# Altium schematic sheet USBHeaders.SchDoc
size A
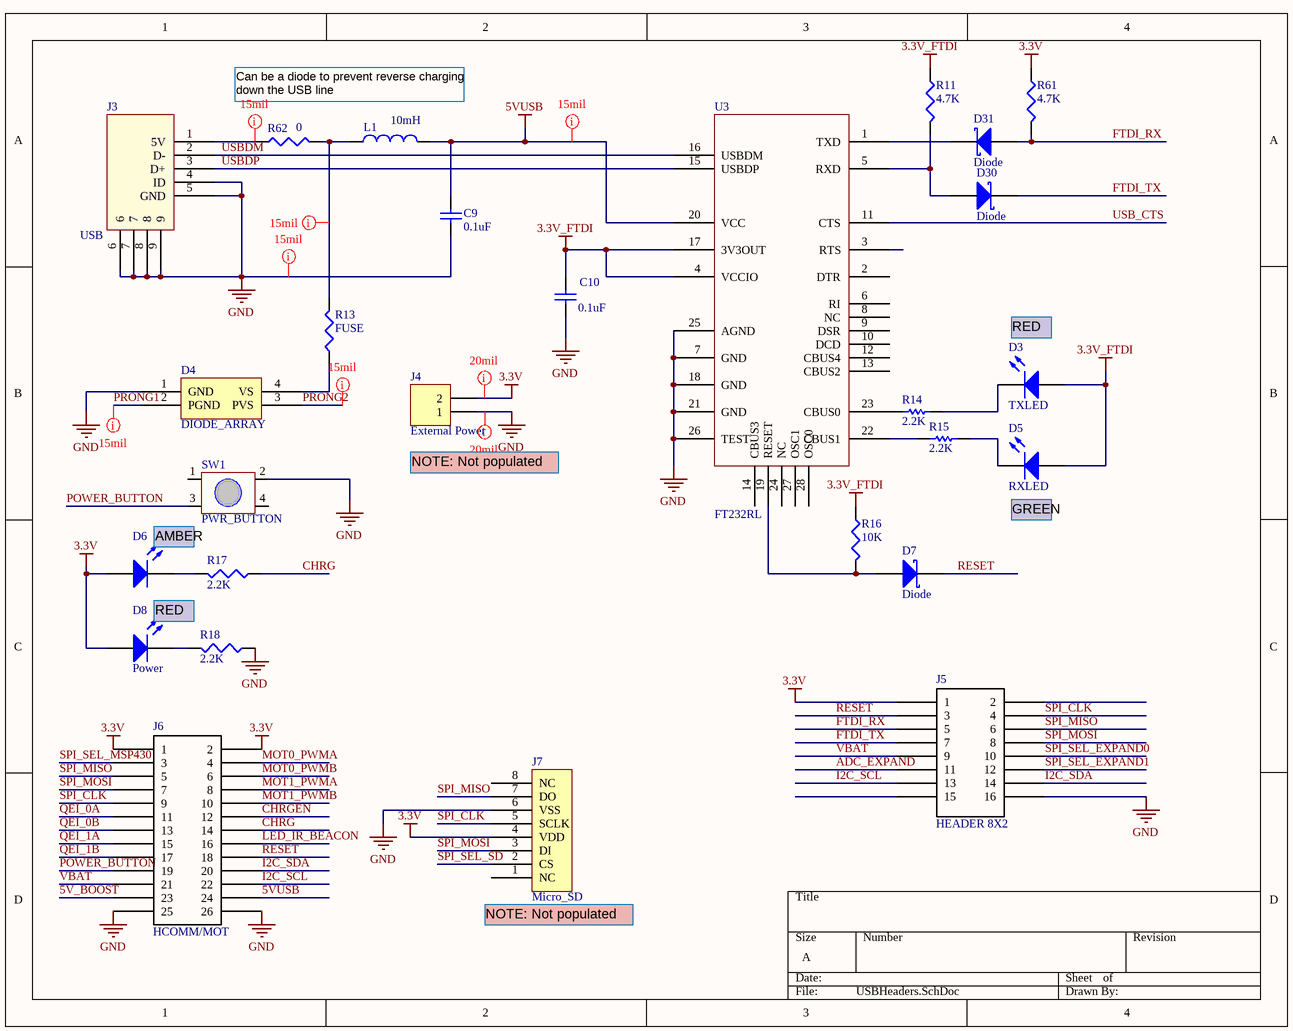
[diagram p0: USBHeaders.SchDoc]

## Parts
C9  value 0.1uF  [CAPC1005L]
C10  value 0.1uF  [CAPC1005L]
D3  TXLED  [SurfaceMount(603)]
D4  DIODE_ARRAY  [SOT143]
D5  RXLED  [SurfaceMount(603)]
D6  Charge  [SurfaceMount(603)]  (value not drawn)
D7  Diode  [SurfaceMount(603)]
D8  Power  [SurfaceMount(603)]
D30  Diode  [SurfaceMount(603)]
D31  Diode  [SurfaceMount(603)]
J3  USB  [USB Minib (thru-hole)]
J4  External Power  [HDR1X2]
J5  HEADER 8X2  [HEADERSM 8X2]
J6  HCOMM/MOT  [HeaderSM 13x2]
J7  Micro_SD  [MICRO_SD]
L1  value 10mH  [INDC2012L]  (hidden comment: Inductor)
R11  value 4.7K  [RESC1608L]  (hidden comment: Res3)
R13  value FUSE  [RESC3225L]  (hidden comment: Res3)
R14  value 2.2K  [RESC1608L]
R15  value 2.2K  [RESC1608L]
R16  value 10K  [RESC1608L]  (hidden comment: Res3)
R17  value 2.2K  [RESC1608L]  (hidden comment: Res3)
R18  value 2.2K  [RESC1608L]  (hidden comment: Res3)
R61  value 4.7K  [RESC1608L]  (hidden comment: Res3)
R62  value 0  [RESC1608L]  (hidden comment: Res3)
SW1  PWR_BUTTON  [SwitchTall-TL330]
U3  FT232RL  [SSOP-28]

## Nets
3.3V: D6.1(A) D8.1(A) J4.2 J5.1 J6.1 J6.2 J7.4(VDD) R61.1
3.3V_FTDI: C10.2 D3.1(A) D5.1(A) R11.1 R16.1 U3.4(VCCIO) U3.17(3V3OUT)
5VUSB: C9.2 J6.24 L1.2 U3.20(VCC)
GND: C9.1 C10.1 D4.1(GND) J3.4(ID) J3.5(GND) J3.6 J3.7 J3.8 J3.9 J4.1 J5.16 J6.25 J6.26 J7.6(VSS) R18.1 SW1.2 U3.7(GND) U3.18(GND) U3.21(GND) U3.25(AGND) U3.26(TEST)
5V_BOOST: J6.23
ADC_EXPAND: J5.11
CHRG: J6.14 R17.1
CHRGEN: J6.12
FTDI_RX: D31.2(A) J5.5 R61.2
FTDI_TX: D30.1(K) J5.7
I2C_SCL: J5.13 J6.22
I2C_SDA: J5.14 J6.20
LED_IR_BEACON: J6.16
MOT0_PWMA: J6.4
MOT0_PWMB: J6.6
MOT1_PWMA: J6.8
MOT1_PWMB: J6.10
POWER_BUTTON: J6.19 SW1.3
PRONG1: D4.2(PGND)
PRONG2: D4.3(PVS)
QEI_0A: J6.11
QEI_0B: J6.13
QEI_1A: J6.15
QEI_1B: J6.17
RESET: D7.1(K) J5.3 J6.18
SPI_CLK: J5.4 J6.9 J7.5(SCLK)
SPI_MISO: J5.6 J6.5 J7.7(DO)
SPI_MOSI: J5.8 J6.7 J7.3(DI)
SPI_SEL_EXPAND0: J5.10
SPI_SEL_EXPAND1: J5.12
SPI_SEL_MSP430: J6.3
SPI_SEL_SD: J7.2(CS)
USB_CTS: U3.11(CTS)
USBDM: J3.2(D-) U3.16(USBDM)
USBDP: J3.3(D+) U3.15(USBDP)
VBAT: J5.9 J6.21
NetD3_2: D3.2(K) R14.2
NetD4_4: D4.4(VS) R13.1
NetD5_2: D5.2(K) R15.2
NetD6_2: D6.2(K) R17.2
NetD7_2: D7.2(A) R16.2 U3.19(RESET)
NetD8_2: D8.2(K) R18.2
NetD30_2: D30.2(A) R11.2 U3.5(RXD)
NetD31_1: D31.1(K) U3.1(TXD)
NetJ3_1: J3.1(5V) R62.1
NetL1_1: L1.1 R13.2 R62.2
NetR14_1: R14.1 U3.23(CBUS0)
NetR15_1: R15.1 U3.22(CBUS1)

Not connected (* = marked no-connect by the designer): J5 2 15; J7 1(NC) 8(NC); SW1 1 4; U3 2(DTR) 3(RTS) 6(RI) 8(NC) 9(DSR) 10(DCD) 12(CBUS4) 13(CBUS2) 14(CBUS3) 24(NC) 27(OSC1) 28(OSC0)

## Layout directives
rule Width Constraint [Pref Width = 15mil    Min Width = 8mil    Max Width = 20mil]: 3.3V, GND
rule Width Constraint [Pref Width = 8mil    Min Width = 8mil    Max Width = 15mil]: 5VUSB, GND, NetJ3_1, NetL1_1, PRONG1, PRONG2

## Notes on the sheet
- Can be a diode to prevent reverse charging down the USB line
- (near D3) RED
- (near J4) NOTE: Not populated
- (near D5) GREEN
- AMBER
- RED
- (near J7) NOTE: Not populated

## Library data of the parts
C9 C10 = Cap: Capacitor; Published: 8-Jun-2000; LatestRevisionDate: 17-Jul-2002; LatestRevisionNote: Re-released for DXP Platform.; PackageReference: RAD-0.3; Publisher: Altium Limited
D3 D5 D6 = LED2: Typical RED, GREEN, YELLOW, AMBER GaAs LED; Published: 8-Jun-2000; LatestRevisionDate: 17-Jul-2002; LatestRevisionNote: Re-released for DXP Platform.; PackageVersion: Feb-2002; PackageReference: 3.2X1.6X1.1; Publisher: Altium Limited
D4 = SCHOTTKEY_DIODE_ARRAY
D7 D30 D31 = SchottkeyDiode
D8 = LED
J3 = USB-ConnTH
J4 = Header 2: Header, 2-Pin; LatestRevisionDate: 17-Jul-2002; LatestRevisionNote: Re-released for DXP Platform.; Publisher: Altium Limited
J5 = HEADERS 8X2
J6 = HCOMM/HMOT: Header, 2X20, 50mil, IDC
L1 = Inductor: Code_IEC: 1005; Published: 8-Jun-2000; LatestRevisionDate: 29-May-2009; LatestRevisionNote: IPC-7351 Footprint Added.; PackageReference: 0402-A; Publisher: Altium Limited; PackageDescription: Chip Inductor; Code_JEITA: 0402
R11 R13 R16-R18 R61 R62 = Res3: Resistor; Published: 8-Jun-2000; LatestRevisionDate: 29-May-2009; LatestRevisionNote: IPC-7351 Footprint Added.; PackageReference: J1-0603; Publisher: Altium Limited; PackageDescription: Chip Resistor
R14 R15 = Res1: Resistor; Published: 8-Jun-2000; LatestRevisionDate: 17-Jul-2002; LatestRevisionNote: Re-released for DXP Platform.; PackageReference: AXIAL-0.3; Publisher: Altium Limited
SW1 = Switch-TL330